# EAGLE design BLE_POV_clock_v1.0 (EAGLE 9.6.2)
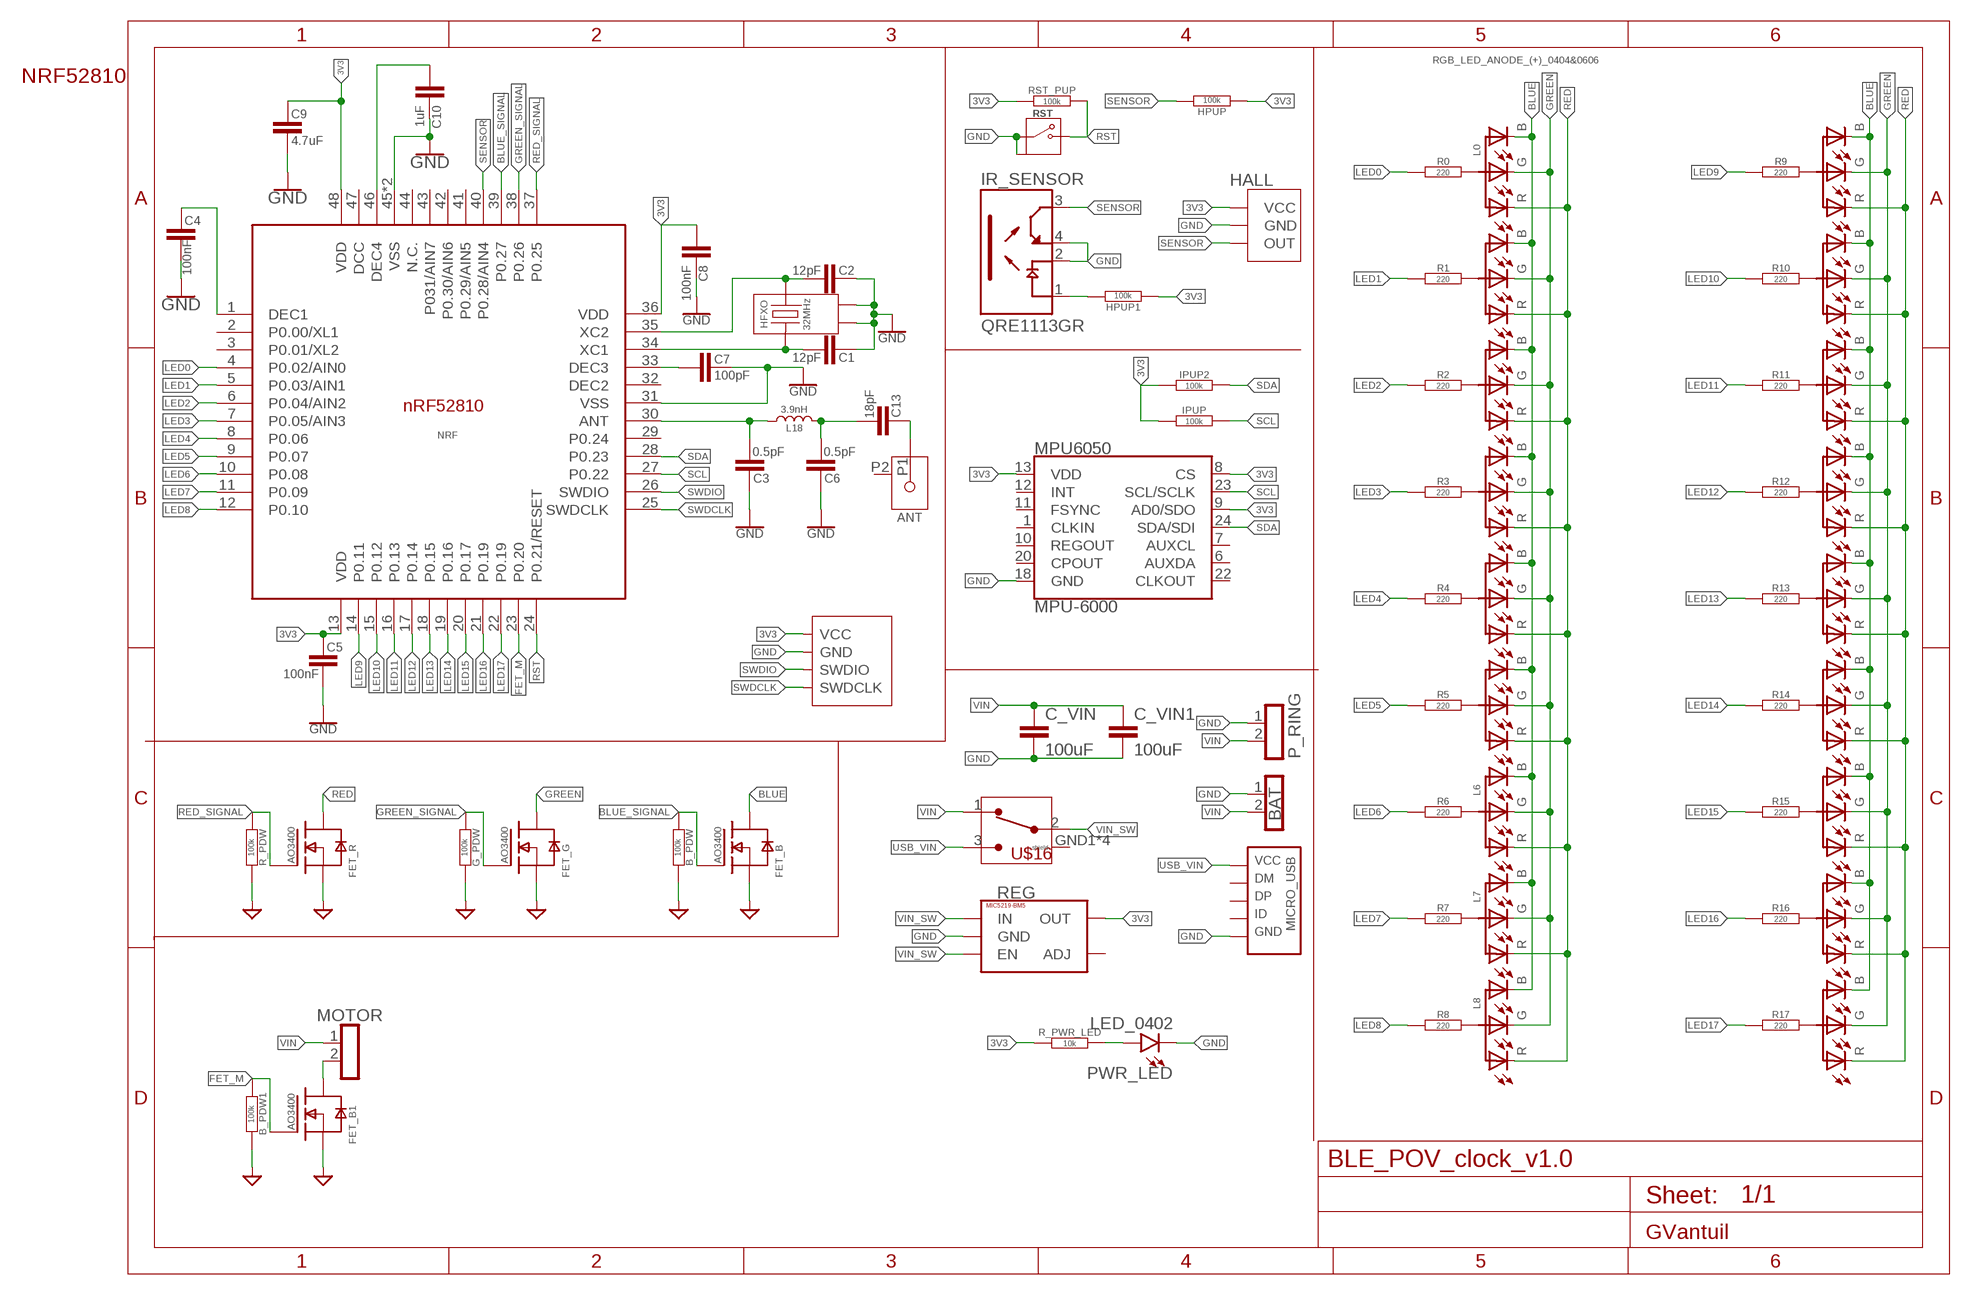
[diagram p0: schematic, sheet 1]

## Parts
ANT  ANT3216LL00R2400A  [ANT3216LL00R2400A]
B_PDW  100k  RESISTOR0402-RES  [0402-RES]
B_PDW1  100k  RESISTOR0402-RES  [0402-RES]
BAT  PINH1X02  [1X02]
C1  12pF  CAP_0402-CAP  [0402-CAP]
C2  12pF  CAP_0402-CAP  [0402-CAP]
C3  0.5pF  CAP_0402-CAP  [0402-CAP]
C4  100nF  CAP_0402-CAP  [0402-CAP]
C5  100nF  CAP_0402-CAP  [0402-CAP]
C6  0.5pF  CAP_0402-CAP  [0402-CAP]
C7  100pF  CAP_0402-CAP  [0402-CAP]
C8  100nF  CAP_0402-CAP  [0402-CAP]
C9  4.7uF  CAP_1206  [1206]
C10  1uF  CAP_0402-CAP  [0402-CAP]
C13  18pF  CAP_0402-CAP  [0402-CAP]
C_VIN  100uF  CAP_1206  [1206]
C_VIN1  100uF  CAP_1206  [1206]
FET_B  AO3400  [SOT23-3]
FET_B1  AO3400  [SOT23-3]
FET_G  AO3400  [SOT23-3]
FET_R  AO3400  [SOT23-3]
G_PDW  100k  RESISTOR0402-RES  [0402-RES]
HALL  49E  [TO92_HALLSENSOR]
HFXO  32MHz  XTAL_CX2016DB16000D0WZRC1  [XTAL_CX2016DB16000D0WZRC1]
HPUP  100k  RESISTOR0402-RES  [0402-RES]
HPUP1  100k  RESISTOR0402-RES  [0402-RES]
IPUP  100k  RESISTOR0402-RES  [0402-RES]
IPUP2  100k  RESISTOR0402-RES  [0402-RES]
IR_SENSOR  QRE1113GR  [SOIC180P460X187-4N]
L0  RGB_LED_ANODE_(+)_0404&0606  [LED_RGB_0404&0606]
L1  RGB_LED_ANODE_(+)_0404&0606  [LED_RGB_0404&0606]
L2  RGB_LED_ANODE_(+)_0404&0606  [LED_RGB_0404&0606]
L3  RGB_LED_ANODE_(+)_0404&0606  [LED_RGB_0404&0606]
L4  RGB_LED_ANODE_(+)_0404&0606  [LED_RGB_0404&0606]
L5  RGB_LED_ANODE_(+)_0404&0606  [LED_RGB_0404&0606]
L6  RGB_LED_ANODE_(+)_0404&0606  [LED_RGB_0404&0606]
L7  RGB_LED_ANODE_(+)_0404&0606  [LED_RGB_0404&0606]
L8  RGB_LED_ANODE_(+)_0404&0606  [LED_RGB_0404&0606]
L9  RGB_LED_ANODE_(+)_0404&0606  [LED_RGB_0404&0606]
L10  RGB_LED_ANODE_(+)_0404&0606  [LED_RGB_0404&0606]
L11  RGB_LED_ANODE_(+)_0404&0606  [LED_RGB_0404&0606]
L12  RGB_LED_ANODE_(+)_0404&0606  [LED_RGB_0404&0606]
L13  RGB_LED_ANODE_(+)_0404&0606  [LED_RGB_0404&0606]
L14  RGB_LED_ANODE_(+)_0404&0606  [LED_RGB_0404&0606]
L15  RGB_LED_ANODE_(+)_0404&0606  [LED_RGB_0404&0606]
L16  RGB_LED_ANODE_(+)_0404&0606  [LED_RGB_0404&0606]
L17  RGB_LED_ANODE_(+)_0404&0606  [LED_RGB_0404&0606]
L18  3.9nH  IND_0402  [0402]
MICRO_USB  USBSMALLGND  [MICROUSB_SMALLGND]
MOTOR  PINH1X02_1.27  [1X02_1.27]
MPU6050  MPU-6000  [QFN-24-EP]
NRF  NORDIC_NRF_NRF52810_QF  [NRF52810_QFN40P600X600X90-48_N_3MMTHERMAL]
P_RING  RING_PAD_2_4X6  [2X_RING_PAD_4X6]
PWR_LED  LED_0402  [0402]
R0  220  RESISTOR0402-RES  [0402-RES]
R1  220  RESISTOR0402-RES  [0402-RES]
R2  220  RESISTOR0402-RES  [0402-RES]
R3  220  RESISTOR0402-RES  [0402-RES]
R4  220  RESISTOR0402-RES  [0402-RES]
R5  220  RESISTOR0402-RES  [0402-RES]
R6  220  RESISTOR0402-RES  [0402-RES]
R7  220  RESISTOR0402-RES  [0402-RES]
R8  220  RESISTOR0402-RES  [0402-RES]
R9  220  RESISTOR0402-RES  [0402-RES]
R10  220  RESISTOR0402-RES  [0402-RES]
R11  220  RESISTOR0402-RES  [0402-RES]
R12  220  RESISTOR0402-RES  [0402-RES]
R13  220  RESISTOR0402-RES  [0402-RES]
R14  220  RESISTOR0402-RES  [0402-RES]
R15  220  RESISTOR0402-RES  [0402-RES]
R16  220  RESISTOR0402-RES  [0402-RES]
R17  220  RESISTOR0402-RES  [0402-RES]
R_PDW  100k  RESISTOR0402-RES  [0402-RES]
R_PWR_LED  10k  RESISTOR0402-RES  [0402-RES]
REG  MIC5219-BM5  [SOT23-5]
RST  PUSHBUTTON_2X4X3.5  [2X4X3.5MM]
RST_PUP  100k  RESISTOR0402-RES  [0402-RES]
U$2  GV_SWD_4P  [GV_SWD_1.27MM_4P_SEMI_SMD]
U$16  SMD_SWITCH  [SMD_SWITCH]

## Nets
3V3: C5.1 C8.2 C9.1 HALL.VCC HPUP1.1 HPUP.1 IPUP2.1 IPUP.1 MPU6050.8(CS) MPU6050.9(AD0/SDO) MPU6050.13(VDD) NRF.13(VDD) NRF.36(VDD) NRF.48(VDD) R_PWR_LED.1 REG.5(OUT) RST_PUP.1 U$2.VCC
BLUE: FET_B.3(D) L0.B1(LED_BLUE) L0.B(LED_BLUE) L1.B1(LED_BLUE) L1.B(LED_BLUE) L2.B1(LED_BLUE) L2.B(LED_BLUE) L3.B1(LED_BLUE) L3.B(LED_BLUE) L4.B1(LED_BLUE) L4.B(LED_BLUE) L5.B1(LED_BLUE) L5.B(LED_BLUE) L6.B1(LED_BLUE) L6.B(LED_BLUE) L7.B1(LED_BLUE) L7.B(LED_BLUE) L8.B1(LED_BLUE) L8.B(LED_BLUE) L9.B1(LED_BLUE) L9.B(LED_BLUE) L10.B1(LED_BLUE) L10.B(LED_BLUE) L11.B1(LED_BLUE) L11.B(LED_BLUE) L12.B1(LED_BLUE) L12.B(LED_BLUE) L13.B1(LED_BLUE) L13.B(LED_BLUE) L14.B1(LED_BLUE) L14.B(LED_BLUE) L15.B1(LED_BLUE) L15.B(LED_BLUE) L16.B1(LED_BLUE) L16.B(LED_BLUE) L17.B1(LED_BLUE) L17.B(LED_BLUE)
BLUE_SIGNAL: B_PDW.1 FET_B.1(G) NRF.39(P0.27)
FET_M: B_PDW1.1 FET_B1.1(G) NRF.23(P0.20)
GND: B_PDW1.2 B_PDW.2 BAT.1 C1.1 C2.1 C3.2 C4.2 C5.2 C6.2 C7.1 C8.1 C9.2 C10.1 C_VIN1.2 C_VIN.2 FET_B1.2(S) FET_B.2(S) FET_G.2(S) FET_R.2(S) G_PDW.2 HALL.GND HFXO.2 HFXO.4 IR_SENSOR.2(C) IR_SENSOR.4(ET) MICRO_USB.5(5.GND) MICRO_USB.5.GND1(5.GND) MICRO_USB.5.GND4(5.GND) MPU6050.18(GND) NRF.31(VSS) NRF.45(VSS) NRF.PAD(VSS) P_RING.1 PWR_LED.C R_PDW.2 REG.2(GND) RST.2 RST.GND RST.GND2(GND) U$2.GND
GREEN: FET_G.3(D) L0.G1(LED_GREEN) L0.G(LED_GREEN) L1.G1(LED_GREEN) L1.G(LED_GREEN) L2.G1(LED_GREEN) L2.G(LED_GREEN) L3.G1(LED_GREEN) L3.G(LED_GREEN) L4.G1(LED_GREEN) L4.G(LED_GREEN) L5.G1(LED_GREEN) L5.G(LED_GREEN) L6.G1(LED_GREEN) L6.G(LED_GREEN) L7.G1(LED_GREEN) L7.G(LED_GREEN) L8.G1(LED_GREEN) L8.G(LED_GREEN) L9.G1(LED_GREEN) L9.G(LED_GREEN) L10.G1(LED_GREEN) L10.G(LED_GREEN) L11.G1(LED_GREEN) L11.G(LED_GREEN) L12.G1(LED_GREEN) L12.G(LED_GREEN) L13.G1(LED_GREEN) L13.G(LED_GREEN) L14.G1(LED_GREEN) L14.G(LED_GREEN) L15.G1(LED_GREEN) L15.G(LED_GREEN) L16.G1(LED_GREEN) L16.G(LED_GREEN) L17.G1(LED_GREEN) L17.G(LED_GREEN)
GREEN_SIGNAL: FET_G.1(G) G_PDW.1 NRF.38(P0.26)
LED0: NRF.4(P0.02/AIN0) R0.1
LED1: NRF.5(P0.03/AIN1) R1.1
LED2: NRF.6(P0.04/AIN2) R2.1
LED3: NRF.7(P0.05/AIN3) R3.1
LED4: NRF.8(P0.06) R4.1
LED5: NRF.9(P0.07) R5.1
LED6: NRF.10(P0.08) R6.1
LED7: NRF.11(P0.09) R7.1
LED8: NRF.12(P0.10) R8.1
LED9: NRF.14(P0.11) R9.1
LED10: NRF.15(P0.12) R10.1
LED11: NRF.16(P0.13) R11.1
LED12: NRF.17(P0.14) R12.1
LED13: NRF.18(P0.15) R13.1
LED14: NRF.19(P0.16) R14.1
LED15: NRF.20(P0.17) R15.1
LED16: NRF.21(P0.19) R16.1
LED17: NRF.22(P0.19) R17.1
MOTOR: FET_B1.3(D) MOTOR.2
N$1: C1.2 HFXO.3 NRF.34(XC1)
N$2: C2.2 HFXO.1 NRF.35(XC2)
N$3: C7.2 NRF.33(DEC3)
N$4: L0.COM1(COMMON_ANODE) L0.COM(COMMON_ANODE) R0.2
N$5: L1.COM1(COMMON_ANODE) L1.COM(COMMON_ANODE) R1.2
N$6: L2.COM1(COMMON_ANODE) L2.COM(COMMON_ANODE) R2.2
N$7: L3.COM1(COMMON_ANODE) L3.COM(COMMON_ANODE) R3.2
N$8: C10.2 NRF.46(DEC4)
N$10: C3.1 L18.1 NRF.30(ANT)
N$11: C4.1 NRF.1(DEC1)
N$12: HPUP1.2 IR_SENSOR.1(A)
N$13: L4.COM1(COMMON_ANODE) L4.COM(COMMON_ANODE) R4.2
N$14: L5.COM1(COMMON_ANODE) L5.COM(COMMON_ANODE) R5.2
N$15: L6.COM1(COMMON_ANODE) L6.COM(COMMON_ANODE) R6.2
N$17: L7.COM1(COMMON_ANODE) L7.COM(COMMON_ANODE) R7.2
N$18: C6.1 C13.1 L18.2
N$19: ANT.P1 C13.2
N$20: L8.COM1(COMMON_ANODE) L8.COM(COMMON_ANODE) R8.2
N$21: L9.COM1(COMMON_ANODE) L9.COM(COMMON_ANODE) R9.2
N$22: L10.COM1(COMMON_ANODE) L10.COM(COMMON_ANODE) R10.2
N$23: L11.COM1(COMMON_ANODE) L11.COM(COMMON_ANODE) R11.2
N$24: L12.COM1(COMMON_ANODE) L12.COM(COMMON_ANODE) R12.2
N$25: L13.COM1(COMMON_ANODE) L13.COM(COMMON_ANODE) R13.2
N$26: L14.COM1(COMMON_ANODE) L14.COM(COMMON_ANODE) R14.2
N$27: L15.COM1(COMMON_ANODE) L15.COM(COMMON_ANODE) R15.2
N$28: L16.COM1(COMMON_ANODE) L16.COM(COMMON_ANODE) R16.2
N$29: L17.COM1(COMMON_ANODE) L17.COM(COMMON_ANODE) R17.2
N$30: PWR_LED.A R_PWR_LED.2
RED: FET_R.3(D) L0.R1(LED_RED) L0.R(LED_RED) L1.R1(LED_RED) L1.R(LED_RED) L2.R1(LED_RED) L2.R(LED_RED) L3.R1(LED_RED) L3.R(LED_RED) L4.R1(LED_RED) L4.R(LED_RED) L5.R1(LED_RED) L5.R(LED_RED) L6.R1(LED_RED) L6.R(LED_RED) L7.R1(LED_RED) L7.R(LED_RED) L8.R1(LED_RED) L8.R(LED_RED) L9.R1(LED_RED) L9.R(LED_RED) L10.R1(LED_RED) L10.R(LED_RED) L11.R1(LED_RED) L11.R(LED_RED) L12.R1(LED_RED) L12.R(LED_RED) L13.R1(LED_RED) L13.R(LED_RED) L14.R1(LED_RED) L14.R(LED_RED) L15.R1(LED_RED) L15.R(LED_RED) L16.R1(LED_RED) L16.R(LED_RED) L17.R1(LED_RED) L17.R(LED_RED)
RED_SIGNAL: FET_R.1(G) NRF.37(P0.25) R_PDW.1
RST: NRF.24(P0.21/RESET) RST.1 RST_PUP.2
SCL: IPUP.2 MPU6050.23(SCL/SCLK) NRF.27(P0.22)
SDA: IPUP2.2 MPU6050.24(SDA/SDI) NRF.28(P0.23)
SENSOR: HALL.OUT HPUP.2 IR_SENSOR.3(CT) NRF.40(P0.28/AIN4)
SWDCLK: NRF.25(SWDCLK) U$2.SWDCLK
SWDIO: NRF.26(SWDIO) U$2.SWDIO
USB_VIN: MICRO_USB.1(1.VCC) U$16.3
VIN: BAT.2 C_VIN1.1 C_VIN.1 MOTOR.1 P_RING.2 U$16.1
VIN_SW: REG.1(IN) REG.3(EN) U$16.2
Unconnected: ANT.P2 MICRO_USB.2(2.DM) MICRO_USB.3(3.DP) MICRO_USB.4(4.ID) MPU6050.1(CLKIN) MPU6050.6(AUXDA) MPU6050.7(AUXCL) MPU6050.10(REGOUT) MPU6050.11(FSYNC) MPU6050.12(INT) MPU6050.20(CPOUT) MPU6050.22(CLKOUT) NRF.2(P0.00/XL1) NRF.3(P0.01/XL2) NRF.29(P0.24) NRF.32(DEC2) NRF.41(P0.29/AIN5) NRF.42(P0.30/AIN6) NRF.43(P031/AIN7) NRF.44(N.C.) NRF.47(DCC) REG.4(ADJ) U$16.GND1 U$16.GND2 U$16.GND3 U$16.GND4

## Notes on the sheet
- NRF52810

## Library data of the parts
ANT = 0000_GV_antennas:ANT3216LL00R2400A
B_PDW B_PDW1 G_PDW HPUP HPUP1 IPUP IPUP2 R0 R1-R17 R_PDW R_PWR_LED RST_PUP = 0000_GV_resistors:RESISTOR: Resistor Basic schematic elements and footprints for 0603, 1206, and PTH 1/10th watt (small) resistors.
BAT MOTOR = 0000_GV_connectors:PINH1X02
C1-C10 C13 C_VIN C_VIN1 = 0000_GV_capacitors:CAP_: Capacitor Standard 0603 ceramic capacitor, and 0.1" leaded capacitor.
FET_B FET_B1 FET_G FET_R = 0000_GV_transistors:AO3400: Check prices <https://pricing.snapeda.com/parts/AO3400/Alpha%20%26/view-part?ref=eda>
HALL = 0000_GV_sensors:49E
HFXO = 0000_GV_cristal_and _timers:XTAL: Crystal 16MHz 8pF 4-Pin SMD Check availability <https://pricing.snapeda.com/parts/CX2016DB16000D0WZRC1/Kyocera%20AVX/view-part?ref=eda>; AVAILABILITY: In Stock; MF: Kyocera AVX; MP: CX2016DB16000D0WZRC1; PACKAGE: None; PRICE: None; PURCHASE-URL: https://pricing.snapeda.com/search/part/CX2016DB16000D0WZRC1/?ref=eda
IR_SENSOR = 0000_GV_sensors:QRE1113GR: QRE1113 Series 30 V 50 mA Miniature Reflective Object Sensor - SMD-4 Check availability <https://pricing.snapeda.com/parts/QRE1113GR/ON%20Semiconductor/view-part?ref=eda>; AVAILABILITY: In Stock; CHECK_PRICES: https://www.snapeda.com/parts/QRE1113GR/Onsemi/view-part/?ref=eda; DESCRIPTION: Reflective Optical Sensor 0.039 (1mm) 4-SMD, Gull Wing; MF: ON Semiconductor; MP: QRE1113GR; PACKAGE: ARUSM-313-4 ON Semiconductor; PRICE: None; SNAPEDA_LINK: https://www.snapeda.com/parts/QRE1113GR/Onsemi/view-part/?ref=snap
L0 L1-L17 = 0000_GV_Leds:RGB_LED_ANODE_(+)
L18 = 0000_GV_inductors:IND
MICRO_USB = 0000_GV_connectors:USB: http://www.aliexpress.com/item/Copper-Micro-USB-Female-Socket-MK5P-SMD-PIN/1928761583.html?spm=2114.01010208.3.10.qK37XJ&ws_ab_test=searchweb201556_0,searchweb201602_4_10036_10035_10034_507_10032_10020_2000015_10001_10002_10017_10010_10005_10006_10011_10003_10021_10004_10022_10009_10008_10018_10019,searchweb201603_8&btsid=d506cece-2c25-48f3-a337-d3a85711c2df mini usb - sparkful
MPU6050 = 0000_GV_sensors:MPU-6000: Invensense MPU-6000 6-Axis Gryoscope/Accelerometer 3-axis gyroscope, 3-axis accelerometer in a 4x4 package. The MPU-6000 is the world’s first 6-axis I²C MotionTracking device designed for the low power, low cost, and high performance requirements of smartphones, tablets and wearable sensors. Datasheet <http://cdn.sparkfun.com/datasheets/Components/General%20IC/PS-MPU-6000A.pdf> SparkFun Products MPU-6000 - Motion Processing Unit <https://www.sparkfun.com/products/11234> (SEN-11234) SparkFun UDB5 - PIC UAV Development Board <https://www.sparkfun.com/products/11703> (GPS-11703); PROD_ID: IC-11089; SF_ID: SEN-11234
NRF = 0000_GV_MCUs:NORDIC_NRF_NRF52810_QF: nRF52810 Features Single chip, highly flexible, 2.4 GHz multi-protocol SoC 32-bit ARM Cortex-M4 Processor 1.7v to 3.6v operation 192kB flash + 24kB RAM Supports concurrent Bluetooth low energy/ANT protocol operation Up to +4dBm output power -96dBm sensitivity, Bluetooth low energy Thread safe and run-time protected Event driven API On air compatible with nRF24L and nRF24AP series 2 data rates (2Mbps/1Mbps) PPI - maximum flexibility for power-efficient applications and code simplification Automated power management system with automatic power management of each peripheral Configurable I/O mapping for analog and digital I/O 1 x Master/Slave SPI 1 x Two-wire interface (I²C) UART (RTS/CTS) 1 x PWM (4 channels) AES HW encryption 8-channel 10/12-bit ADC Quadrature decoder 64-level analog comparator Real Time Counter (RTC) Digital microphone interface (PDM) On-chip balun Applications Bluetooth 5 connectivity processor Industrial sensors and actuators Wearables SmartHome sensors computer peripherals RF smart remotes Airfuel (A4WP) wireless charging Beacons Sports and fitness sensors Connected health products Smart watches RC Toys Interactive games Building automation
P_RING = 0000_GV_connectors:RING_PAD_2
PWR_LED = 0000_GV_Leds:LED
REG = 0000_GV_regulators:MIC5219-BM5
RST = 0000_GV_switches:PUSHBUTTON_2X4X3.5
U$2 = 0000_GV_connectors:GV_SWD_4P
U$16 = 0000_GV_switches:SMD_SWITCH

## Board
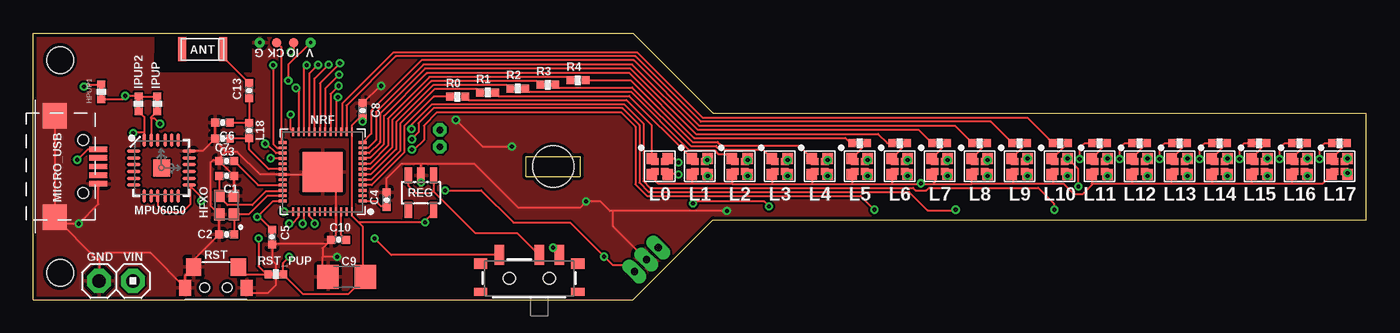
[diagram p1: board, top side]
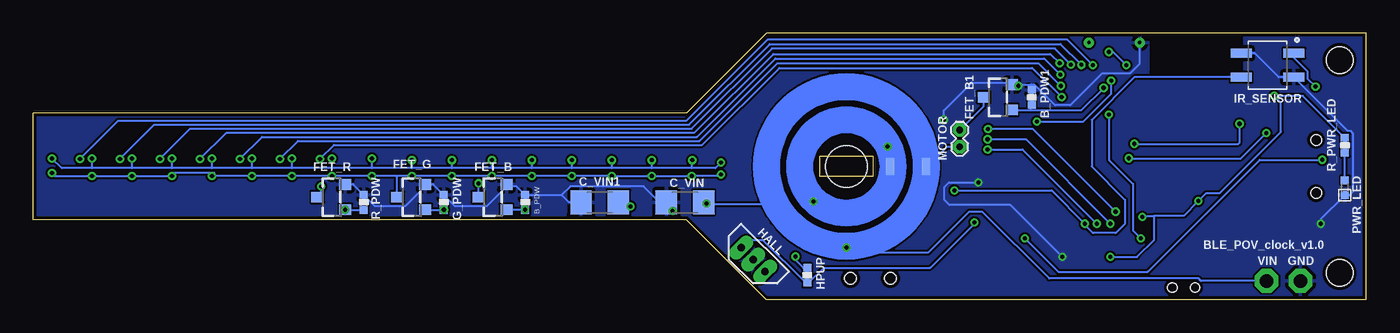
[diagram p2: board, bottom side, seen from below]

Size 100 x 20 mm. Coordinates in mm from the lower left corner, seen from the top.
Outline: 100,6 100,14 51,14 45,20 0,20 0,0 45,0 51,6 100,6
Copper layers (1*16): Top 0.035mm / dielectric 1.5mm / Bottom 0.035mm
Design rules "SeeedStudio_2layer_DRU_no_angle_20140221": minimum track width 6mil, minimum drill 12mil, track to track 6mil, track to pad 6mil, pad to pad 6mil, via to via 6mil, smd to smd 0mil, copper to edge 10mil, drill to drill 10mil, minimum pad ring 10mil, minimum via ring 6mil, stop-mask expansion 2mil, vias tented up to drill 100mil, thermal gap 10mil
Holes 2 mm at 2,2 2,18
tRestrict: area 9.2,17.1 to 16.3,19.9
bRestrict: area 9.3,17.1 to 16.2,19.9

### Footprints (pad centres in the part's own frame; a part is rotated, then mirrored left to right if it is on the bottom)
ANT3216LL00R2400A = smd 1.8 x 0.6: P1 0,1.55; P2 0,-1.55
0402-RES = smd 0.6 x 0.6: 1 -0.55,0; 2 0.55,0
1X02 = drill 1.016 pad 1.778 octagon: 1 -1.27,0; 2 1.27,0
0402-CAP = smd 0.6 x 0.6: 1 -0.55,0; 2 0.55,0
1206 = smd 1.6 x 1.8: 1 -1.4,0; 2 1.4,0
SOT23-3 = smd 0.8 x 0.9: 1 -0.95,-1; 2 0.95,-1; 3 0,1.1
TO92_HALLSENSOR = drill 0.55 pad 1.016 long: GND 0,0; OUT -1.27,0; VCC 1.27,0
XTAL_CX2016DB16000D0WZRC1 = smd 0.9 x 0.8: 1 -0.7,-0.55; 2 0.7,-0.55; 3 0.7,0.55; 4 -0.7,0.55
SOIC180P460X187-4N = smd 0.69 x 1.57: 1 -0.9,1.975; 2 -0.9,-1.975; 3 0.9,-1.975; 4 0.9,1.975
LED_RGB_0404&0606 = smd 0.8 x 0.8: B -0.6,-0.6; COM -0.6,0.6; G 0.6,-0.6; R 0.6,0.6 | smd 0.55 x 0.55: B1 -0.375,-0.375; COM1 -0.375,0.375; G1 0.375,-0.375; R1 0.375,0.375
0402 = smd 0.6 x 0.6: 1 -0.55,0; 2 0.55,0
MICROUSB_SMALLGND = smd 0.4 x 1.35: 1 -1.3,3.27; 2 -0.65,3.27; 3 0,3.27; 4 0.65,3.27; 5 1.3,3.27 | smd 1.9 x 1.8: 5.GND1 -3.809,0; 5.GND4 3.809,0 | hole 0.8: -2,2.15; 2,2.15
1X02_1.27 = drill 0.5 pad 0.813 octagon: 1 -0.635,0; 2 0.635,0
QFN-24-EP = smd 1.016 x 0.254: 1 -2.066,1.257; 2 -2.066,0.75; 3 -2.066,0.247; 4 -2.066,-0.287; 5 -2.066,-0.792; 6 -2.066,-1.297; 13 2.086,-1.297; 14 2.086,-0.792; 15 2.086,-0.287; 16 2.086,0.247; 17 2.086,0.75; 18 2.086,1.257 | smd 0.254 x 1.016: 7 -1.267,-2.122; 8 -0.762,-2.122; 9 -0.258,-2.122; 10 0.278,-2.122; 11 0.78,-2.122; 12 1.287,-2.122; 19 1.287,2.082; 20 0.78,2.082; 21 0.278,2.082; 22 -0.258,2.082; 23 -0.762,2.082; 24 -1.267,2.082 | smd 1.27 x 1.27: P$1 0.02,-0.01
NRF52810_QFN40P600X600X90-48_N_3MMTHERMAL = smd 0.65 x 0.2: 1 -3,2.2; 2 -3,1.8; 3 -3,1.4; 4 -3,1; 5 -3,0.6; 6 -3,0.2; 7 -3,-0.2; 8 -3,-0.6; 9 -3,-1; 10 -3,-1.4; 11 -3,-1.8; 12 -3,-2.2; 25 3,-2.2; 26 3,-1.8; 27 3,-1.4; 28 3,-1; 29 3,-0.6; 30 3,-0.2; 31 3,0.2; 32 3,0.6; 33 3,1; 34 3,1.4; 35 3,1.8; 36 3,2.2 | smd 0.2 x 0.65: 13 -2.2,-3; 14 -1.8,-3; 15 -1.4,-3; 16 -1,-3; 17 -0.6,-3; 18 -0.2,-3; 19 0.2,-3; 20 0.6,-3; 21 1,-3; 22 1.4,-3; 23 1.8,-3; 24 2.2,-3; 37 2.2,3; 38 1.8,3; 39 1.4,3; 40 1,3; 41 0.6,3; 42 0.2,3; 43 -0.2,3; 44 -0.6,3; 45 -1,3; 46 -1.4,3; 47 -1.8,3; 48 -2.2,3 | smd 3 x 3: PAD 0,0
2X_RING_PAD_4X6 = smd 0.635 x 1.27: 1 -3.302,0; 2 -5.969,0 | hole 3.1: 0,0
0402' = smd 0.6 x 0.6: A -0.55,0; C 0.55,0
SOT23-5 = smd 0.55 x 1.2: 1 -0.95,-1.3; 2 0,-1.3; 3 0.95,-1.3; 4 0.95,1.3; 5 -0.95,1.3
2X4X3.5MM = smd 1.15 x 1.3: 1 -1.675,-1.55; 2 1.675,-1.55 | smd 0.9 x 1.2: GND -2.3,0; GND2 2.3,0 | hole 0.7: -0.85,0; 0.85,0
GV_SWD_1.27MM_4P_SEMI_SMD = drill 0.25 pad 0.7: GND 1.905,0; VCC -1.905,0 | smd 0.7 x 0.7: SWDCLK 0.635,0; SWDIO -0.635,0
SMD_SWITCH = smd 0.7 x 1.5: 1 -2.25,-1.75; 2 -0.75,-1.75; 3 2.25,-1.75 | smd 1 x 0.6: GND1 -3.65,1; GND3 3.65,1 | smd 1 x 0.8: GND2 -3.65,-1.1; GND4 3.65,-1.1 | hole 0.9: -1.5,0; 1.5,0

### Placement (x,y rotation side)
ANT  12.7,18.8 270 top
B_PDW  63.1,7.3 90 bottom
B_PDW1  25.1,15.2 90 bottom
BAT  6.2,1.4 0 top
C1  14.5,9.3 180 top
C2  14.5,4.9 0 top
C3  14.2,12.1 180 top
C4  26.5,7.5 90 top
C5  17.9,4.7 270 top
C6  14.2,13.3 180 top
C7  14.5,10.4 0 top
C8  24.7,14.2 270 top
C9  23.5,1.7 180 top
C10  22.9,4.5 0 top
C13  16.2,15.7 90 top
C_VIN  51.1,7.3 180 bottom
C_VIN1  57.5,7.3 180 bottom
FET_B  65.5,7.7 90 bottom
FET_B1  27.6,15.2 90 bottom
FET_G  71.6,7.7 90 bottom
FET_R  77.6,7.7 90 bottom
G_PDW  69.2,7.3 90 bottom
HALL  46,3 135 bottom
HFXO  14.5,7.1 90 top
HPUP  41.92,1.83 90 bottom
HPUP1  5.1,15.6 90 top
IPUP  9.3,14.7 270 top
IPUP2  7.9,14.7 270 top
IR_SENSOR  7.4,17.6 270 bottom
L0  47,10 0 top
L1  50,10 0 top
L2  53,10 0 top
L3  56,10 0 top
L4  59,10 0 top
L5  62,10 0 top
L6  65,10 0 top
L7  68,10 0 top
L8  71,10 0 top
L9  74,10 0 top
L10  77,10 0 top
L11  80,10 0 top
L12  83,10 0 top
L13  86,10 0 top
L14  89,10 0 top
L15  92,10 0 top
L16  95,10 0 top
L17  98,10 0 top
L18  16.2,12.7 90 top
MICRO_USB  1.6,10 270 top
MOTOR  30.5,12.1 90 bottom
MPU6050  9.6,9.9 0 top
NRF  21.7,9.6 180 top
P_RING  39,10 180 bottom
PWR_LED  LED_0402  [0402']  1.6,8.4 270 bottom
R0  31.83,15.24 0 top
R1  34.09,15.54 0 top
R2  36.35,15.85 0 top
R3  38.61,16.13 0 top
R4  40.87,16.47 0 top
R5  62,11.75 0 top
R6  65,11.75 0 top
R7  68,11.75 0 top
R8  71,11.75 0 top
R9  74,11.75 0 top
R10  77.05,11.75 0 top
R11  80,11.75 0 top
R12  83,11.75 0 top
R13  86,11.75 0 top
R14  89,11.75 0 top
R15  91.95,11.75 0 top
R16  95,11.75 0 top
R17  98,11.75 0 top
R_PDW  75.2,7.3 90 bottom
R_PWR_LED  1.6,11.6 270 bottom
REG  29.08,8.03 180 top
RST  13.7,0.9 180 top
RST_PUP  18.2,1.9 180 top
U$2  18.9,19.3 180 top
U$7  [GV_5MM_METAL]  7.6,6.3 0 bottom
U$16  37.2,1.6 180 top

### Tracks (layer width: path | path; a pad name or v marks a point on that pad's centre or on a via)
3V3  (via drill 0.3 pad 0.5)
  Top 0.152: 24.4,5.8 v29.4,5.8 29.4,5.9 30.03,6.53 REG.5 | 24.4,5.8 23.9,6.3 NRF.48 NRF.13 23.9,13.1 24.45,13.65 C8.2 v24.7,13.37 | NRF.36 18,7.4 v16.8,6.2 16.95,6.2 C5.1 | IPUP.1 IPUP2.1 7.83,15.32 7,15.32 | 24.4,5.8 24.7,5.5 24.7,1.9 C9.1 23.6,0.4 20.25,0.4 RST_PUP.1 18.75,2.75 v19.2,3.2 | v6.9,15.3 6.92,15.32 7,15.32 | MPU6050.8 MPU6050.9 9.34,7.06 9.8,6.6 11.2,6.6 11.8,7.2 11.8,8.49 MPU6050.13 12.6,7.69 v12.6,7.41 | HPUP1.1 6.72,15.05 7,15.32 | U$2.VCC 19.13,17.63 v19.13,16.43
  Bottom 0.152: HALL.VCC 46.3,4.5 45.3,4.5 42.08,1.28 HPUP.1 41.82,1.28 40.7,2.4 32.7,2.4 29.4,5.7 v29.4,5.8 | 15.9,6.3 13.7,6.3 v12.6,7.41 11.99,8.01 10.99,8.01 6.4,12.6 6.4,14.8 v6.9,15.3 4.75,15.3 R_PWR_LED.1 | v16.8,6.2 16.7,6.3 15.9,6.3 | v24.7,13.37 21.23,13.37 19.13,15.47 v19.13,16.43 | v19.2,3.2 17.2,3.2 15.9,4.5 15.9,6.3
BLUE  (via drill 0.3 pad 0.5)
  Top 0.152: 52.4,8.7 49.4,8.7 | 49.4,8.7 46.9,8.7 46.4,9.2 L0.B 46.4,9.5 L0.B1 | L1.B1 L1.B 49.4,8.7 | 52.4,8.7 L2.B 52.4,9.5 L2.B1 | L10.B1 L10.B 76.5,9.3 76.5,8.7 | 70.4,8.7 L8.B 70.4,9.5 L8.B1 | 52.4,8.7 55.4,8.7 | 55.4,8.7 58.4,8.7 | 58.4,8.7 61.4,8.7 | 61.4,8.7 64.4,8.7 | 64.4,8.7 66.6,8.7 | 66.6,8.7 67.5,8.7 | 67.5,8.7 70.4,8.7 | L3.B1 L3.B 55.4,8.7 | L4.B1 L4.B 58.4,8.7 | L5.B1 L5.B 61.4,8.7 | 64.4,8.7 L6.B 64.4,9.5 L6.B1 | 67.5,8.7 67.63,8.82 L7.B1 67.4,9.5 L7.B | 94.4,8.7 96.7,8.7 L17.B 97.4,9.5 L17.B1 | 94.4,8.7 91.5,8.7 | 91.5,8.7 88.4,8.7 | 88.4,8.7 85.4,8.7 | 85.4,8.7 82.4,8.7 | 82.4,8.7 79.5,8.7 | 79.5,8.7 79.4,8.7 L11.B L11.B1 | 76.5,8.7 77.3,8.7 78.1,7.9 78.7,7.9 79.5,8.7 | 76.5,8.7 73.5,8.7 | 73.5,8.7 70.4,8.7 | 73.5,8.7 73.5,9.3 L9.B 73.4,9.5 L9.B1 | L12.B1 L12.B 82.4,8.7 | 85.4,8.7 L13.B 85.4,9.5 L13.B1 | L14.B1 L14.B 88.4,8.7 | 94.4,8.7 L16.B 94.4,9.5 L16.B1 | L15.B1 91.4,9.5 L15.B 91.4,8.8 91.5,8.7 | v66.6,8.73 66.6,8.7
  Bottom 0.152: FET_B.3 v66.6,8.73
BLUE_SIGNAL  (via drill 0.3 pad 0.5)
  Top 0.152: B_PDW.1 62.06,7.79 46.03,7.79 45.16,8.65 45.16,12.98 44.08,14.06 30.3,14.06 29.3,13.06 29.3,12 28.58,11.28 v28.4,11.28 | v20.2,5.7 20.3,5.8 NRF.39
  Bottom 0.152: B_PDW.1 FET_B.1 | v28.4,11.28 25.78,11.28 v20.2,5.7
  other vias: 63.1,6.75
FET_M  (via drill 0.3 pad 0.5)
  Top 0.152: v19.7,15.9 19.9,15.7 NRF.23
  Bottom 0.152: v19.7,15.9 21.4,14.2 25.2,14.2 | FET_B1.1 26.55,14.2 25.2,14.2 | B_PDW1.1 25.2,14.55 25.2,14.2
GND  (via drill 0.3 pad 0.5)
  Top 0.152: v52.03,6.65 43.5,6.65 | 43.5,6.65 43.27,6.65 42.56,7.36 v41.46,7.36 41,6.9 36.4,6.9 33.1,10.2 29.08,10.2 | 29.08,10.2 REG.2 29.08,8.82 v29.1,8.8 | 29.08,10.2 27.6,10.2 26.5,9.1 C4.2 | HALL.GND 43.5,5.5 43.5,6.65 | C10.1 22.7,4.85 NRF.45 22.7,8.6 NRF.PAD 21.5,9.4 NRF.31 17,9.4 15.3,11.1 14.4,11.1 | HFXO.2 C1.1 C7.1 13.95,10.5 | 14.4,11.1 13.95,10.65 13.95,10.5 | C3.2 13.65,11.9 14.4,11.15 14.4,11.1 | C3.2 C6.2 | C9.2 21.7,2.1 21.7,3.2 | RST.GND 16.4,0.5 17.6,0.5 18.2,1.1 18.2,2.65 17.9,2.95 C5.2 17.95,4.2 22.05,4.2 C10.1 | 4.93,3.03 5.4,3.5 8.8,3.5 RST.GND2 11.4,1.82 RST.2 12.03,2.98 C2.1 HFXO.4 13.3,7.05 13.3,10.3 13.5,10.5 13.95,10.5 | 4.93,3.03 BAT.1 | MICRO_USB.5.GND4 4.76,3.03 4.93,3.03 | v31.7,13.5 33.7,11.5 v35.9,11.5 | C8.1 26,16.05 v26.1,16.05 | MICRO_USB.5.GND4 2.09,5.7 v3.4,5.7 4.87,7.17 MICRO_USB.5 | C3.2 12.71,11.16 MPU6050.18 | v22.8,3.2 21.7,3.2 | C10.1 21.7,3.85 21.7,3.2 | MICRO_USB.5.GND1 MICRO_USB.5.GND4
  Bottom 0.152: v52.03,6.65 52.03,6.83 C_VIN.2 53,7.3 54.2,8.5 59.7,8.5 60.35,7.85 | C_VIN1.2 59.8,7.3 60.35,7.85 | FET_R.2 76,8.65 R_PDW.2 74.35,7 72.1,7 70.6,8.5 FET_G.2 70,8.65 G_PDW.2 68.35,7 66,7 64.5,8.5 | FET_B.2 64.5,8.5 | 64.5,8.5 63.75,8.5 B_PDW.2 60.35,7.85 | v41.46,7.36 36.94,7.36 35.7,8.6 P_RING.1 35.7,11.3 v35.9,11.5 | v31.7,13.5 31.7,14.2 29.6,16.3 26.45,16.3 26.2,16.05 v26.1,16.05 26.2,16.15 FET_B1.2 25.1,16.15 | PWR_LED.C 1.62,7.83 | 1.62,7.83 3.4,6.05 v3.4,5.7 | v22.8,3.2 26.7,7.1 31.25,7.1 31.63,7.48 31.63,8.47 31.3,8.8 v29.1,8.8 | IR_SENSOR.2 8.38,18.5 6.58,16.7 IR_SENSOR.4 1.4,12.68 1.21,12.68 1,12.47 1,8.1 1.27,7.83 1.62,7.83 | 25.1,16.15 24.9,16.15 23.35,14.6 22.2,14.6 19.8,17 17.7,17 17,17.7 U$2.GND | B_PDW1.2 25.1,16.15
  pour Bottom: -0.1,20 100,20 100,0 -0.1,0
  pour Top: -0.5,0 -0.5,20 101,20 101,0
GREEN  (via drill 0.3 pad 0.5)
  Top 0.152: v98.6,9.5 L17.G 98.4,9.5 L17.G1 | v89.6,9.27 L14.G 89.4,9.5 L14.G1 | L12.G1 L12.G v83.6,9.27 | v80.6,9.27 L11.G 80.4,9.5 L11.G1 | v56.6,9.27 L3.G 56.4,9.5 L3.G1 | v50.6,9.27 L1.G 50.4,9.5 L1.G1 | v77.6,9.27 L10.G 77.4,9.5 L10.G1 | v68.6,9.27 L7.G 68.4,9.5 L7.G1 | v65.6,9.27 L6.G 65.4,9.5 L6.G1 | v62.6,9.27 L5.G 62.4,9.5 L5.G1 | v59.6,9.27 L4.G 59.4,9.5 L4.G1 | L0.G1 47.58,9.43 48.38,9.43 v48.4,9.4 | 47.4,9.5 47.38,9.53 L0.G1 | v95.6,9.27 L16.G 95.4,9.5 L16.G1 | v92.6,9.27 L15.G 92.4,9.5 L15.G1 | v74.6,9.27 L9.G L9.G1 | L8.G1 L8.G v71.6,9.27 | 53.4,9.5 L2.G | 53.4,9.5 L2.G1 | 53.4,9.5 v53.6,9.27 | 47.4,9.5 L0.G1 | 47.4,9.5 L0.G | 86.4,9.5 L13.G1 | 86.4,9.5 L13.G | 86.4,9.5 v86.6,9.27
  Bottom 0.152: v48.4,9.4 48.27,9.27 v50.6,9.27 50.63,9.3 53.58,9.3 v53.6,9.28 v53.6,9.27 53.63,9.3 56.58,9.3 v56.6,9.27 56.63,9.3 59.6,9.3 | 59.6,9.3 62.6,9.3 | 62.6,9.3 65.57,9.3 | 65.57,9.3 68.6,9.3 | 68.6,9.3 71.6,9.3 | 71.6,9.3 72.7,9.3 | 72.7,9.3 77.57,9.3 | 77.57,9.3 83.8,9.3 | 83.8,9.3 86.6,9.3 v86.6,9.27 86.4,9.5 89.4,9.5 v89.6,9.27 89.63,9.3 92.6,9.3 | 95.6,9.3 98.4,9.3 v98.6,9.5 | 95.6,9.3 92.6,9.3 | 83.8,9.3 83.77,9.27 v83.6,9.27 | 77.57,9.3 v77.6,9.27 77.58,9.3 80.58,9.3 v80.6,9.27 | 71.6,9.3 v71.6,9.27 71.58,9.3 74.58,9.3 v74.6,9.27 | v68.6,9.27 68.6,9.3 | 65.57,9.3 v65.6,9.27 | v62.6,9.27 62.6,9.3 | v59.6,9.27 59.6,9.3 | v95.6,9.27 95.6,9.3 | v92.6,9.27 92.6,9.3 | FET_G.3 72.7,9.3
GREEN_SIGNAL  (via drill 0.3 pad 0.5)
  Top 0.152: G_PDW.1 69.15,6.7 67.09,6.7 65.7,8.09 46.16,8.09 45.47,8.78 45.47,13.11 44.2,14.37 30.03,14.37 28.9,13.24 28.9,12.58 28.4,12.08 v28.4,12.04 | v19.2,5.7 19.4,5.7 19.9,6.2 NRF.38
  Bottom 0.152: FET_G.1 G_PDW.1 | v28.4,12.04 25.54,12.04 v19.2,5.7
  other vias: 69.2,6.75
LED0
  Top 0.152: R0.1 30.04,15.24 27.83,13.04 27.83,11.05 25.39,8.6 NRF.4
LED1
  Top 0.152: R1.1 33.29,15.79 30.11,15.79 27.53,13.21 27.53,11.17 25.36,9 NRF.5
LED2
  Top 0.152: R2.1 35.55,16.1 29.98,16.1 27.22,13.34 27.22,11.3 25.32,9.4 NRF.6
LED3
  Top 0.152: R3.1 37.78,16.4 29.86,16.4 26.92,13.46 26.92,11.43 25.29,9.8 NRF.7
LED4
  Top 0.152: R4.1 40.08,16.71 29.73,16.71 26.61,13.59 26.61,11.55 25.26,10.2 NRF.8
LED5
  Top 0.152: R5.1 61.32,11.75 60.93,12.14 49.58,12.14 44.71,17.01 29.7,17.01 29.55,17.01 29.52,17.01 26.31,13.8 26.31,11.68 25.3,10.67 24.77,10.67 NRF.9
LED6
  Top 0.152: R6.1 64.07,11.75 63.37,12.45 49.71,12.45 44.8,17.36 29.39,17.36 26,13.97 26,11.87 26,11.8 25.2,11 NRF.10
LED7
  Top 0.152: R7.1 67.4,11.75 66.4,12.75 49.84,12.75 44.93,17.66 29.26,17.66 25.7,14.1 25.7,12 25.1,11.4 NRF.11
LED8
  Top 0.152: R8.1 69.14,13.06 49.96,13.06 45.05,17.97 29.12,17.97 25.36,14.21 25.36,12.46 NRF.12
LED9
  Top 0.152: R9.1 71.84,13.36 50.09,13.36 45.18,18.27 27.19,18.27 23.5,14.58 NRF.14
LED10
  Top 0.152: R10.1 74.58,13.67 50.21,13.67 45.3,18.57 27.04,18.57 23.17,14.7 23.17,12.67 NRF.15
LED11  (via drill 0.3 pad 0.5)
  Top 0.152: v22.85,15.2 22.85,15.15 22.7,15 NRF.16 | R11.1 78.9,11.75 78.5,11.35 v78.5,10.55
  Bottom 0.152: v78.5,10.55 77.44,11.61 49.83,11.61 44.04,17.4 25.05,17.4 v22.85,15.2
LED12  (via drill 0.3 pad 0.5)
  Top 0.152: R12.1 81.9,11.75 81.5,11.35 v81.5,10.55 | v22.9,16.05 22.3,15.45 NRF.17
  Bottom 0.152: v81.5,10.55 80.14,11.91 50.02,11.91 44.19,17.75 24.6,17.75 v22.9,16.05
LED13  (via drill 0.3 pad 0.5)
  Top 0.152: R13.1 84.9,11.75 84.5,11.35 v84.5,10.55 | NRF.18 21.9,15.85 v22.95,16.9
  Bottom 0.152: v84.5,10.55 82.83,12.22 50.22,12.22 44.34,18.1 24.15,18.1 v22.95,16.9
LED14  (via drill 0.3 pad 0.5)
  Top 0.152: v87.5,10.55 87.5,11.35 87.9,11.75 R14.1 | v23,17.75 21.5,16.25 NRF.19
  Bottom 0.152: v23,17.75 23.7,18.45 44.49,18.45 50.41,12.52 85.53,12.52 v87.5,10.55
LED15  (via drill 0.3 pad 0.5)
  Top 0.152: R15.1 90.85,11.75 90.5,11.4 v90.5,10.55 | NRF.20 21.1,16.6 v22.15,17.65
  Bottom 0.152: v90.5,10.55 88.22,12.83 50.61,12.83 44.58,18.86 23.35,18.86 v22.15,17.65
LED16  (via drill 0.3 pad 0.5)
  Top 0.152: R16.1 93.9,11.75 93.5,11.35 v93.5,10.55 | v21.37,17.63 20.7,16.96 NRF.21
  Bottom 0.152: v93.5,10.55 90.92,13.13 50.8,13.13 44.79,19.15 44.74,19.2 22.94,19.2 v21.37,17.63
LED17  (via drill 0.3 pad 0.5)
  Top 0.152: R17.1 96.9,11.75 96.5,11.35 v96.5,10.55 | NRF.22 20.3,17.4 v20.5,17.6
  Bottom 0.152: v96.5,10.55 93.61,13.44 51,13.44 44.93,19.5 22.41,19.5 v20.5,17.6 | v96.5,10.55
MOTOR
  Bottom 0.152: MOTOR.2 28.7,14.54 FET_B1.3
N$1
  Top 0.152: NRF.34 18.63,8.13 17.45,8.13 16.42,7.1 14.58,7.1 14.04,7.64 13.95,7.73 HFXO.3 C1.2
N$2
  Top 0.152: NRF.35 17.55,7.8 16.15,6.4 HFXO.1 C2.2
N$3
  Top 0.152: C7.2 16.85,8.6 NRF.33
N$4
  Top 0.152: R0.2 32.41,15.24 32.66,14.99 44.49,14.99 46.4,13.08 L0.COM 46.5,10.5 L0.COM1
N$5
  Top 0.152: R1.2 34.67,15.54 34.92,15.3 44.7,15.3 L1.COM 49.5,10.5 L1.COM1
N$6
  Top 0.152: R2.2 37.16,15.6 44.83,15.6 49.2,11.23 51.1,11.23 51.38,10.95 52.19,10.95 52.63,10.51 L2.COM1 52.5,10.62 L2.COM
N$7
  Top 0.152: R3.2 39.36,15.93 44.94,15.93 49.33,11.53 51.22,11.53 51.5,11.25 54.75,11.25 L3.COM | L3.COM L3.COM1 55.38,10.62 L3.COM
N$8
  Top 0.152: C10.2 23.1,4.85 NRF.46
N$10
  Top 0.152: NRF.30 17.67,9.8 16.2,11.27 L18.1 16.15,12.1 C3.1
N$11
  Top 0.152: NRF.1 25.7,7.4 26.1,7 26.45,7 C4.1
N$12  (via drill 0.3 pad 0.5)
  Top 0.152: v3.8,16 3.95,16.15 HPUP1.2
  Bottom 0.152: v3.8,16 4.41,16.61 4.41,17.14 5.42,18.15 IR_SENSOR.1
N$13
  Top 0.152: R4.2 44.82,16.47 49.46,11.84 51.35,11.84 51.63,11.56 57.44,11.56 L4.COM 58.5,10.5 L4.COM1
N$14
  Top 0.152: R5.2 L5.COM 61.5,10.5 L5.COM1
N$15
  Top 0.152: R6.2 L6.COM 64.5,10.5 L6.COM1
N$17
  Top 0.152: R7.2 L7.COM 67.5,10.5 L7.COM1
N$18
  Top 0.152: C6.1 16.15,13.3 L18.2 C13.1
N$19
  Top 0.152: C13.2 14.25,18.2 ANT.P1
N$20
  Top 0.152: R8.2 L8.COM 70.5,10.5 L8.COM1
N$21
  Top 0.152: R9.2 73.73,10.93 73.5,10.93 73.5,10.62 L9.COM1 73.5,10.5 L9.COM
N$22
  Top 0.152: R10.2 76.45,10.6 L10.COM 76.5,10.5 L10.COM1
N$23
  Top 0.152: R11.2 L11.COM 79.5,10.5 L11.COM1
N$24
  Top 0.152: R12.2 L12.COM 82.5,10.5 L12.COM1
N$25
  Top 0.152: R13.2 L13.COM 85.5,10.5 L13.COM1
N$26
  Top 0.152: R14.2 L14.COM 88.5,10.5 L14.COM1
N$27
  Top 0.152: R15.2 91.4,10.65 L15.COM 91.5,10.5 L15.COM1
N$28
  Top 0.152: R16.2 L16.COM 94.5,10.5 L16.COM1
N$29
  Top 0.152: R17.2 L17.COM 97.5,10.5 L17.COM1
N$30
  Bottom 0.152: PWR_LED.A R_PWR_LED.2
RED  (via drill 0.3 pad 0.5)
  Top 0.152: L0.R1 47.4,10.5 L0.R 48.1,10.6 v48.4,10.3 | L1.R 50.4,10.5 L1.R1 50.47,10.47 v50.56,10.47 | v53.6,10.47 L2.R 53.5,10.38 L2.R1 | v56.6,10.47 L3.R 56.5,10.38 L3.R1 | v59.6,10.47 L4.R 59.5,10.38 L4.R1 | v62.6,10.47 62.47,10.47 L5.R1 62.62,10.5 L5.R | v65.6,10.47 L6.R 65.5,10.38 L6.R1 | v68.6,10.47 L7.R 68.5,10.38 L7.R1 | v71.6,10.47 L8.R 71.5,10.38 L8.R1 | L16.R L16.R1 | L15.R L15.R1 | v78.4,8.5 78.4,9.8 L10.R 77.5,10.5 77.5,10.38 L10.R1 | L9.R1 74.5,10.38 74.5,10.5 L9.R | L11.R1 80.5,10.38 80.5,10.5 L11.R | L12.R1 83.5,10.38 83.5,10.5 L12.R | L13.R1 86.5,10.38 86.5,10.5 L13.R | L14.R1 89.5,10.38 89.5,10.5 L14.R | L17.R1 98.5,10.38 98.5,10.5 L17.R
  Bottom 0.152: v48.4,10.3 48.83,9.87 50.6,9.87 | L17.R 97.87,9.87 95.6,9.87 | 50.6,9.87 53.6,9.87 | 53.6,9.87 56.6,9.87 | 56.6,9.87 59.6,9.87 | 59.6,9.87 62.6,9.87 | 62.6,9.87 65.6,9.87 | 65.6,9.87 68.6,9.87 | 68.6,9.87 71.6,9.87 | 71.6,9.87 74.6,9.87 | 74.6,9.87 77.6,9.87 | 77.6,9.87 80.6,9.87 | 80.6,9.87 83.6,9.87 | 83.6,9.87 86.6,9.87 | 86.6,9.87 89.6,9.87 | 89.6,9.87 92.6,9.87 | 92.6,9.87 95.6,9.87 | v50.56,10.47 50.6,10.43 50.6,9.87 | v53.6,10.47 53.6,9.87 | v56.6,10.47 56.6,9.87 | v59.6,10.47 59.6,9.87 | v62.6,10.47 62.6,9.87 | v65.6,10.47 65.6,9.87 | v68.6,10.47 68.6,9.87 | v71.6,10.47 71.6,9.87 | L9.R 74.6,9.87 | L10.R 77.6,9.87 | L11.R 80.6,9.87 | L12.R 83.6,9.87 | L13.R 86.6,9.87 | L14.R 89.6,9.87 | L15.R 92.6,9.87 | L16.R 95.6,9.87 | FET_R.3 78.4,8 v78.4,8.5
  other vias: 98.6,10.6 74.6,10.6 77.6,10.6 80.6,10.6 83.6,10.6 86.6,10.6 89.6,10.6 92.6,10.6 95.6,10.6
RED_SIGNAL  (via drill 0.3 pad 0.5)
  Top 0.152: FET_R.1 76.6,7.2 75.41,8.39 67.2,8.39 67.01,8.2 66.2,8.2 66,8.39 46.28,8.39 45.77,8.9 45.77,13.23 44.33,14.68 29.9,14.68 28.37,13.14 v28.37,12.8 | NRF.37 v18.8,6.6
  Bottom 0.152: FET_R.1 R_PDW.1 | v18.8,6.6 25,12.8 v28.37,12.8
  other vias: 76.6,6.75
RST  (via drill 0.3 pad 0.5)
  Top 0.152: RST.1 15.93,1.9 17.5,1.9 | 17.5,1.9 RST_PUP.2 | NRF.24 19.3,12.8 v19.3,13.9 | v16.9,4.6 16.9,2.5 17.5,1.9
  Bottom 0.152: v19.3,13.9 19.3,10.5 17.5,8.7 17.5,5.2 v16.9,4.6
SCL  (via drill 0.3 pad 0.5)
  Top 0.152: IPUP.2 8.84,13.69 8.84,13.6 | 8.84,13.6 MPU6050.23 | NRF.27 18.2,11 17.5,11.7 v17.4,11.7 | v9.5,13.2 9.1,13.6 8.84,13.6
  Bottom 0.152: v17.4,11.7 9.6,11.7 9.5,11.8 v9.5,13.2
SDA  (via drill 0.3 pad 0.5)
  Top 0.152: NRF.28 17.82,10.6 v17.81,10.61 | IPUP2.2 8.33,13.72 8.33,12.6 | 8.33,12.6 MPU6050.24 | v7.5,12.5 7.6,12.6 8.33,12.6
  Bottom 0.152: v17.81,10.61 9.39,10.61 v7.5,12.5
SENSOR  (via drill 0.3 pad 0.5)
  Top 0.152: HALL.OUT 44.63,2.58 43.48,2.58 v42.83,3.23 40.28,5.78 36.02,5.78 33.6,8.2 v30.9,8.2 | v21.1,5.7 21.1,5.87 20.7,6.27 NRF.40
  Bottom 0.152: v42.83,3.23 42.83,2.98 42.22,2.38 HPUP.2 | v30.9,8.2 23.6,8.2 v21.1,5.7 21.1,5.6 20.5,5 18.8,5 18.1,5.7 18.1,7.5 20.6,10 20.6,13.5 17.4,16.7 IR_SENSOR.3
SWDCLK
  Top 0.152: U$2.SWDCLK 18.6,18.96 18.6,11.9 NRF.25
SWDIO  (via drill 0.3 pad 0.5)
  Top 0.152: NRF.26 18.3,11.4 18,11.7 v18,17.6 | U$2.SWDIO 19.54,18.84 v19.3,18.6
  Bottom 0.152: v19.3,18.6 19,18.6 v18,17.6
USB_VIN  (via drill 0.3 pad 0.5)
  Top 0.152: U$16.3 26.85,3.35 v25.6,4.6 | v3.3,10.5 4.1,11.3 MICRO_USB.1
  Bottom 0.152: v25.6,4.6 23.1,2.1 16.4,2.1 8,10.5 v3.3,10.5
VIN  (via drill 0.3 pad 0.5)
  Top 0.152: v55.2,7 54.85,7.35 49.62,7.35 v49.49,7.23 | v39,3.9 39.45,3.45 U$16.1
  Bottom 0.152: 36.32,3.52 32.87,3.52 29.79,6.6 28.8,6.6 23.78,1.58 12.57,1.58 12.39,1.4 BAT.2 | C_VIN1.1 55.8,7 v55.2,7 | v49.49,7.23 49.57,7.3 C_VIN.1 49.57,7.17 44.7,7.17 42.74,5.21 41.16,5.21 40.42,4.46 40.38,4.42 39.48,4.42 39,3.94 | P_RING.2 33.03,9.9 | 33.03,9.9 33.03,7.74 36.32,4.45 36.32,3.52 | 39,3.94 v39,3.9 | 36.32,3.52 38.58,3.52 39,3.94 | MOTOR.1 31.47,11.46 33.03,9.9
VIN_SW
  Top 0.152: REG.3 28.13,8.57 28.7,8 29.83,8 30.03,8.2 | REG.1 30.03,8.2 | 30.03,8.2 30.03,8.13 33.16,5 36.3,5 U$16.2

### Text on the board
tNames: GND | VIN
bNames: GND | VIN